# Altium schematic sheet Sheet.SchDoc
size A3
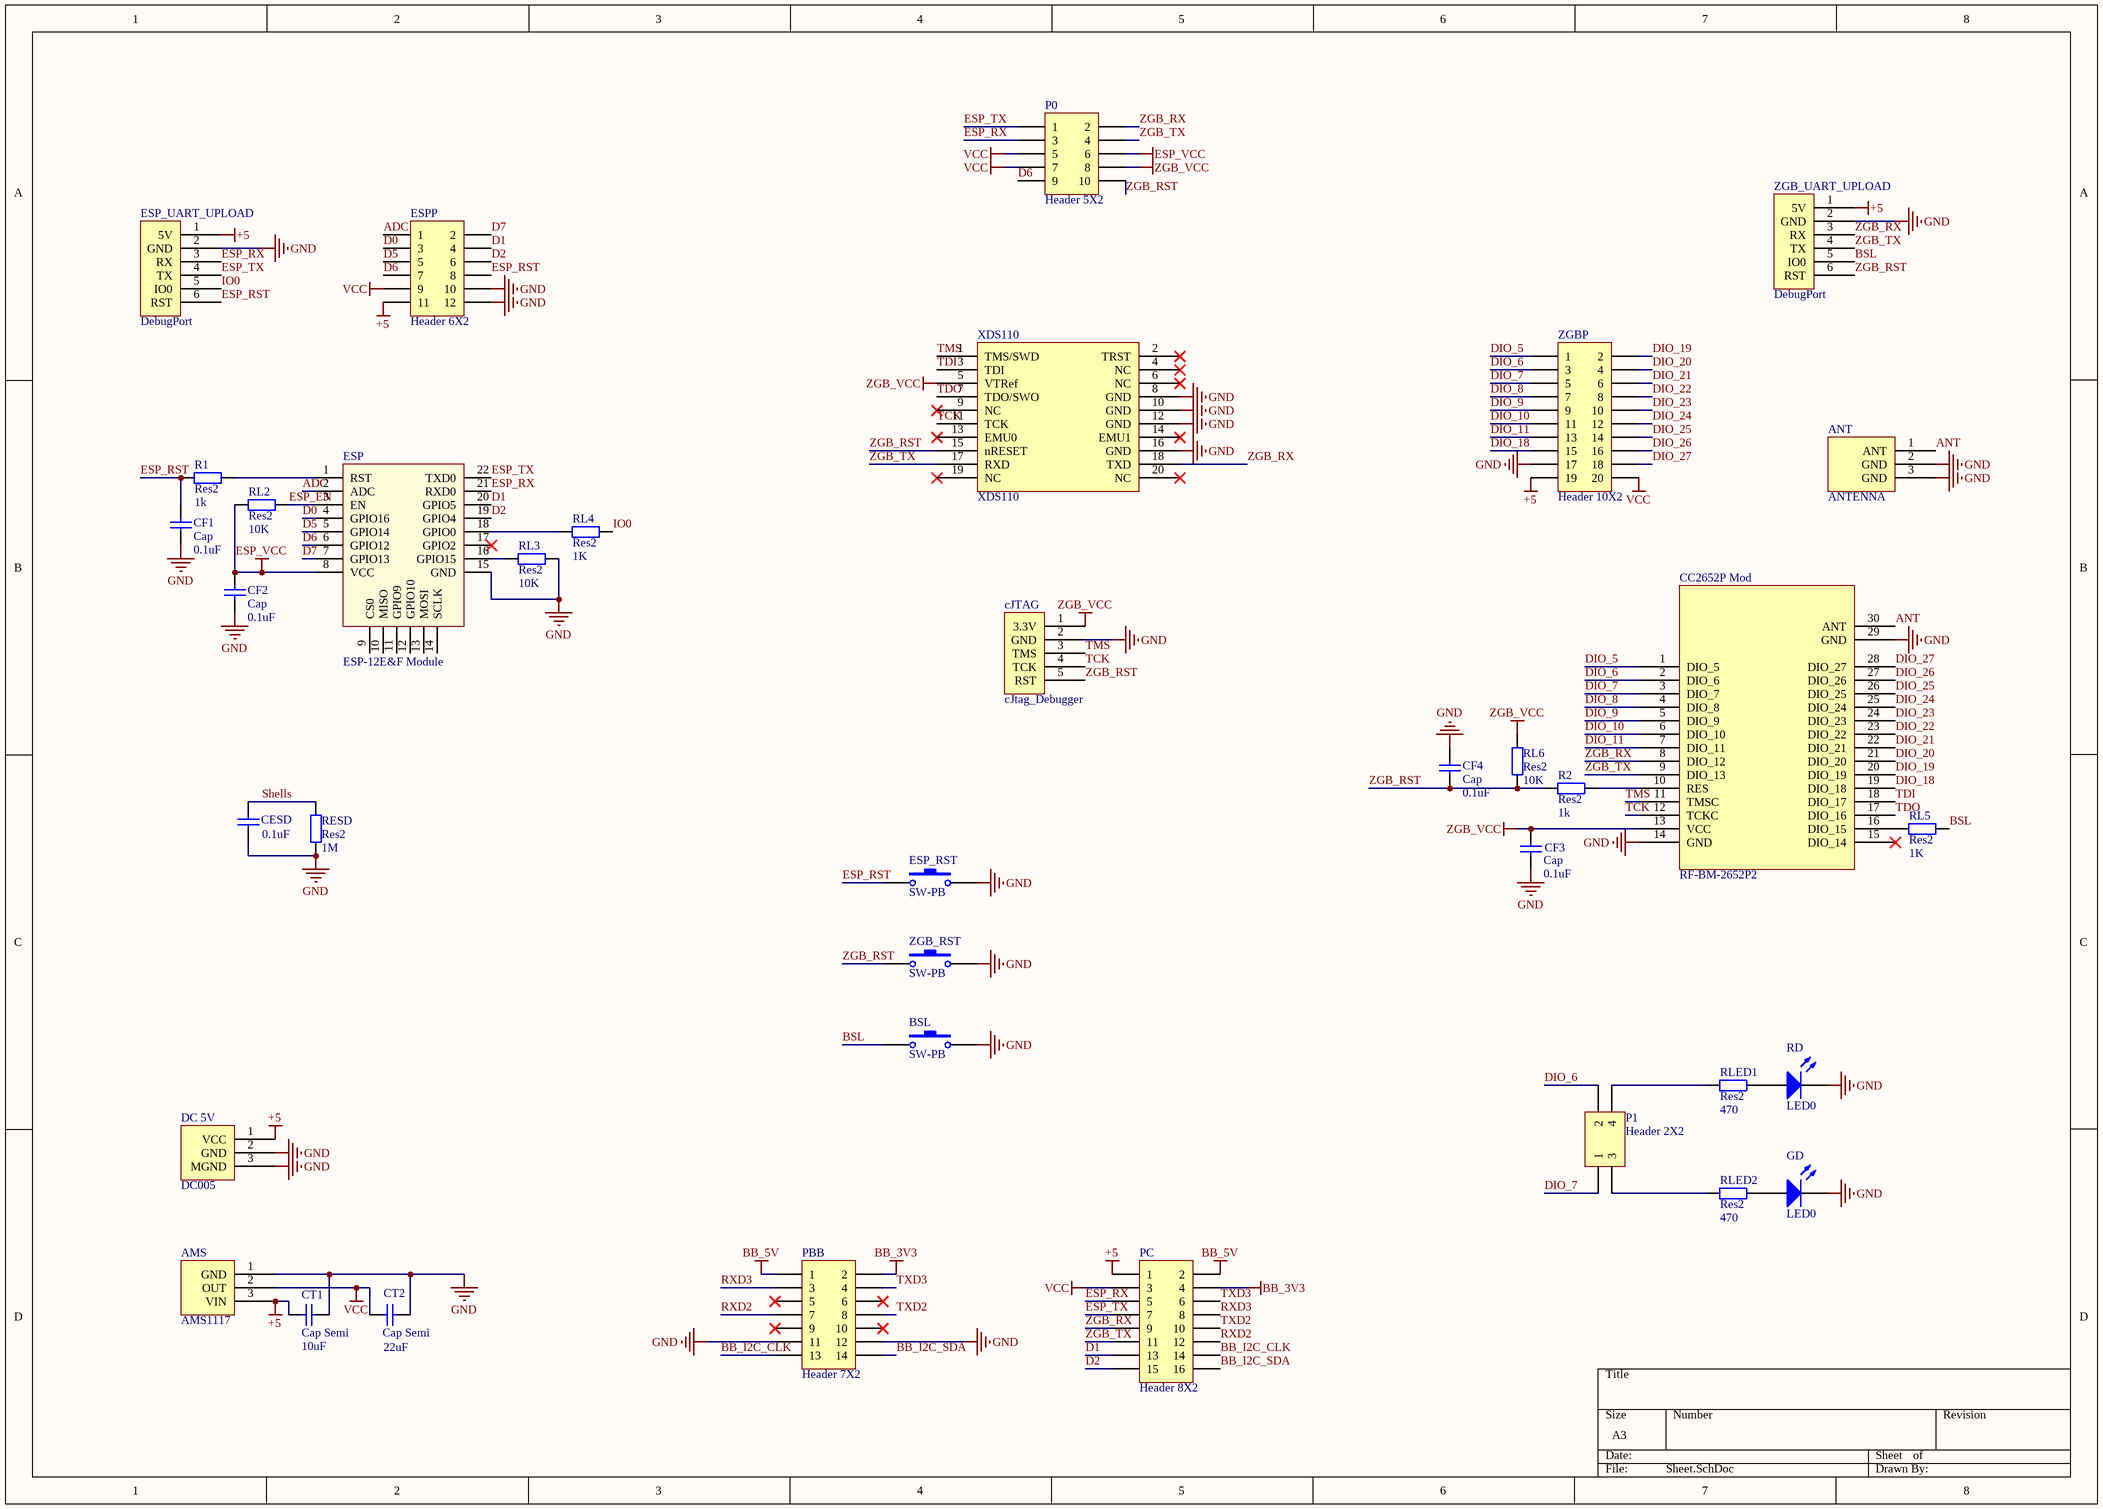
[diagram p0: Sheet.SchDoc]

## Parts
AMS  AMS1117  [SOT-223-2]
ANT  ANTENNA  [SMA-2]
BSL  SW-PB  [TSW SMD-3*6*2.5]
CC2652P_Mod  RF-BM-2652P2  [RF-BM-2652P2]
CESD  value 0.1uF  [My1206]  (hidden comment: Cap)
CF1  Cap  value 0.1uF  [My1206]
CF2  Cap  value 0.1uF  [My1206]
CF3  Cap  value 0.1uF  [My1206]
CF4  Cap  value 0.1uF  [My1206]
cJTAG  cJtag_Debugger  [XH2.54-LI-5P]
CT1  Cap Semi  value 10uF  [My1206]
CT2  Cap Semi  value 22uF  [My1206]
DC_5V  DC005  [DC-005]
ESP  ESP-12E&F Module  [ESP12]
ESP_RST  SW-PB  [TSW SMD-3*6*2.5]
ESP_UART_UPLOAD  DebugPort  [XH2.54-LI-6P]
ESPP  Header 6X2  [IDC3-6*2]
GD  LED0  [My1206]
P0  Header 5X2  [HDR2X5]
P1  Header 2X2  [HDR2X2]
PBB  Header 7X2  [IDC3-7*2]
PC  Header 8X2  [HDR2X8]
R1  Res2  value 1k  [My1206]
R2  Res2  value 1k  [My1206]
RD  LED0  [My1206]
RESD  Res2  value 1M  [My1206]
RL2  Res2  value 10K  [My1206]
RL3  Res2  value 10K  [My1206]
RL4  Res2  value 1K  [My1206]
RL5  Res2  value 1K  [My1206]
RL6  Res2  value 10K  [My1206]
RLED1  Res2  value 470  [My1206]
RLED2  Res2  value 470  [My1206]
XDS110  XDS110  [IDC3-10*2]
ZGB_RST  SW-PB  [TSW SMD-3*6*2.5]
ZGB_UART_UPLOAD  DebugPort  [XH2.54-LI-6P]
ZGBP  Header 10X2  [HDR2X10]

## Nets
+5: AMS.3(VIN) CT1.1 DC_5V.1(VCC) ESP_UART_UPLOAD.1(5V) ESPP.11 PC.1 ZGB_UART_UPLOAD.1(5V) ZGBP.19
BB_3V3: PBB.2 PC.4
BB_5V: PBB.1 PC.2
ESP_VCC: CF2.2 ESP.8(VCC) P0.6 RL2.1
GND: AMS.1(GND) ANT.2(GND) ANT.3(GND) BSL.2 CC2652P_Mod.14(GND) CC2652P_Mod.29(GND) CESD.1 CF1.1 CF2.1 CF3.1 CF4.1 cJTAG.2(GND) CT1.2 CT2.2 DC_5V.2(GND) DC_5V.3(MGND) ESP.15(GND) ESP_RST.2 ESP_UART_UPLOAD.2(GND) ESPP.10 ESPP.12 GD.2(K) PBB.11 PBB.12 RD.2(K) RESD.1 RL3.2 XDS110.8(GND) XDS110.10(GND) XDS110.12(GND) XDS110.16(GND) ZGB_RST.2 ZGB_UART_UPLOAD.2(GND) ZGBP.17
VCC: AMS.2(OUT) CT2.1 ESPP.9 P0.5 P0.7 PC.3 ZGBP.20
ZGB_VCC: CC2652P_Mod.13(VCC) CF3.2 cJTAG.1(3.3V) P0.8 RL6.2 XDS110.5(VTRef)
ADC: ESP.2(ADC) ESPP.1
ANT: ANT.1(ANT) CC2652P_Mod.30(ANT)
BB_I2C_CLK: PBB.13 PC.14
BB_I2C_SDA: PBB.14 PC.16
BSL: BSL.1 RL5.2 ZGB_UART_UPLOAD.5(IO0)
D0: ESP.4(GPIO16) ESPP.3
D1: ESP.20(GPIO5) ESPP.4 PC.13
D2: ESP.19(GPIO4) ESPP.6 PC.15
D5: ESP.5(GPIO14) ESPP.5
D6: ESP.6(GPIO12) ESPP.7 P0.9
D7: ESP.7(GPIO13) ESPP.2
DIO_5: CC2652P_Mod.1(DIO_5) ZGBP.1
DIO_6: CC2652P_Mod.2(DIO_6) P1.2 ZGBP.3
DIO_7: CC2652P_Mod.3(DIO_7) P1.1 ZGBP.5
DIO_8: CC2652P_Mod.4(DIO_8) ZGBP.7
DIO_9: CC2652P_Mod.5(DIO_9) ZGBP.9
DIO_10: CC2652P_Mod.6(DIO_10) ZGBP.11
DIO_11: CC2652P_Mod.7(DIO_11) ZGBP.13
DIO_18: CC2652P_Mod.19(DIO_18) ZGBP.15
DIO_19: CC2652P_Mod.20(DIO_19) ZGBP.2
DIO_20: CC2652P_Mod.21(DIO_20) ZGBP.4
DIO_21: CC2652P_Mod.22(DIO_21) ZGBP.6
DIO_22: CC2652P_Mod.23(DIO_22) ZGBP.8
DIO_23: CC2652P_Mod.24(DIO_23) ZGBP.10
DIO_24: CC2652P_Mod.25(DIO_24) ZGBP.12
DIO_25: CC2652P_Mod.26(DIO_25) ZGBP.14
DIO_26: CC2652P_Mod.27(DIO_26) ZGBP.16
DIO_27: CC2652P_Mod.28(DIO_27) ZGBP.18
ESP_EN: ESP.3(EN) RL2.2
ESP_RST: CF1.2 ESP_RST.1 ESP_UART_UPLOAD.6(RST) ESPP.8 R1.1
ESP_RX: ESP.21(RXD0) ESP_UART_UPLOAD.3(RX) P0.3 PC.5
ESP_TX: ESP.22(TXD0) ESP_UART_UPLOAD.4(TX) P0.1 PC.7
IO0: ESP_UART_UPLOAD.5(IO0) RL4.2
RXD2: PBB.7 PC.12
RXD3: PBB.3 PC.8
Shells: CESD.2 RESD.2
TCK: CC2652P_Mod.12(TCKC) cJTAG.4(TCK) XDS110.11(TCK)
TDI: CC2652P_Mod.18(DIO_17) XDS110.3(TDI)
TDO: CC2652P_Mod.17(DIO_16) XDS110.7(TDO/SWO)
TMS: CC2652P_Mod.11(TMSC) cJTAG.3(TMS) XDS110.1(TMS/SWD)
TXD2: PBB.8 PC.10
TXD3: PBB.4 PC.6
ZGB_RST: CF4.2 cJTAG.5(RST) P0.10 R2.1 RL6.1 XDS110.15(nRESET) ZGB_RST.1 ZGB_UART_UPLOAD.6(RST)
ZGB_RX: CC2652P_Mod.8(DIO_12) P0.2 PC.9 XDS110.18(TXD) ZGB_UART_UPLOAD.3(RX)
ZGB_TX: CC2652P_Mod.9(DIO_13) P0.4 PC.11 XDS110.17(RXD) ZGB_UART_UPLOAD.4(TX)
NetCC2652P_Mod_10: CC2652P_Mod.10(RES) R2.2
NetCC2652P_Mod_16: CC2652P_Mod.16(DIO_15) RL5.1
NetESP_1: ESP.1(RST) R1.2
NetESP_16: ESP.16(GPIO15) RL3.1
NetESP_18: ESP.18(GPIO0) RL4.1
NetGD_1: GD.1(A) RLED2.2
NetP1_3: P1.3 RLED2.1
NetP1_4: P1.4 RLED1.1
NetRD_1: RD.1(A) RLED1.2

Not connected (* = marked no-connect by the designer): CC2652P_Mod 15(DIO_14)*; ESP 9(CS0) 10(MISO) 11(GPIO9) 12(GPIO10) 13(MOSI) 14(SCLK) 17(GPIO2)*; PBB 5* 6* 9* 10*; XDS110 2(TRST)* 4(NC)* 6(NC)* 9(NC)* 13(EMU0)* 14(EMU1)* 19(NC)* 20(NC)*

## Library data of the parts
BSL ESP_RST ZGB_RST = SW-PB: Switch; Published: 24-Mar-1999; LatestRevisionDate: 17-Jul-2002; LatestRevisionNote: Re-released for DXP Platform.; PackageReference: SPST-2; Publisher: Altium Limited; PackageDescription: Switch; 2 Leads
CESD CF1-CF4 = Cap: Capacitor; Published: 8-Jun-2000; LatestRevisionDate: 17-Jul-2002; LatestRevisionNote: Re-released for DXP Platform.; PackageReference: RAD-0.3; Publisher: Altium Limited; PackageDescription: Radial Cap, Thru-Hole; 2 Leads; 0.3 in Pin Spacing
CT1 CT2 = Cap Semi: Capacitor (Semiconductor SIM Model); Published: 8-Jun-2000; LatestRevisionDate: 29-May-2009; LatestRevisionNote: IPC-7351 Footprint Added.; PackageReference: C1206; Publisher: Altium Limited; PackageDescription: Chip Capacitor
ESPP = Header 6X2: Header, 6-Pin, Dual row; LatestRevisionDate: 17-Jul-2002; LatestRevisionNote: Re-released for DXP Platform.; Publisher: Altium Limited
GD RD = LED0: Typical INFRARED GaAs LED; Published: 8-Jun-2000; LatestRevisionDate: 08-Jul-2005; LatestRevisionNote: Mech Layer 1 removed.; PackageReference: LED-0; Publisher: Altium Limited; PackageDescription: LED; 2 Leads
P0 = Header 5X2: Header, 5-Pin, Dual row; LatestRevisionDate: 17-Jul-2002; LatestRevisionNote: Re-released for DXP Platform.; Publisher: Altium Limited
P1 = Header 2X2: Header, 2-Pin, Dual row; LatestRevisionDate: 17-Jul-2002; LatestRevisionNote: Re-released for DXP Platform.; Publisher: Altium Limited
PBB = Header 7X2: Header, 7-Pin, Dual row; LatestRevisionDate: 17-Jul-2002; LatestRevisionNote: Re-released for DXP Platform.; Publisher: Altium Limited
PC = Header 8X2: Header, 8-Pin, Dual row; LatestRevisionDate: 17-Jul-2002; LatestRevisionNote: Re-released for DXP Platform.; Publisher: Altium Limited
R1 R2 RESD RL2-RL6 RLED1 RLED2 = Res2: Resistor; Published: 8-Jun-2000; LatestRevisionDate: 17-Jul-2002; LatestRevisionNote: Re-released for DXP Platform.; PackageReference: AXIAL-0.4; Publisher: Altium Limited; PackageDescription: Axial Device, Thru-Hole; 2 Leads; 0.4 in Pin Spacing
ZGBP = Header 10X2: Header, 10-Pin, Dual row; LatestRevisionDate: 17-Jul-2002; LatestRevisionNote: Re-released for DXP Platform.; Publisher: Altium Limited